# EAGLE design Grove - I2C High Accuracy Temp&Humi Sensor (SHT35) (EAGLE 6.4)
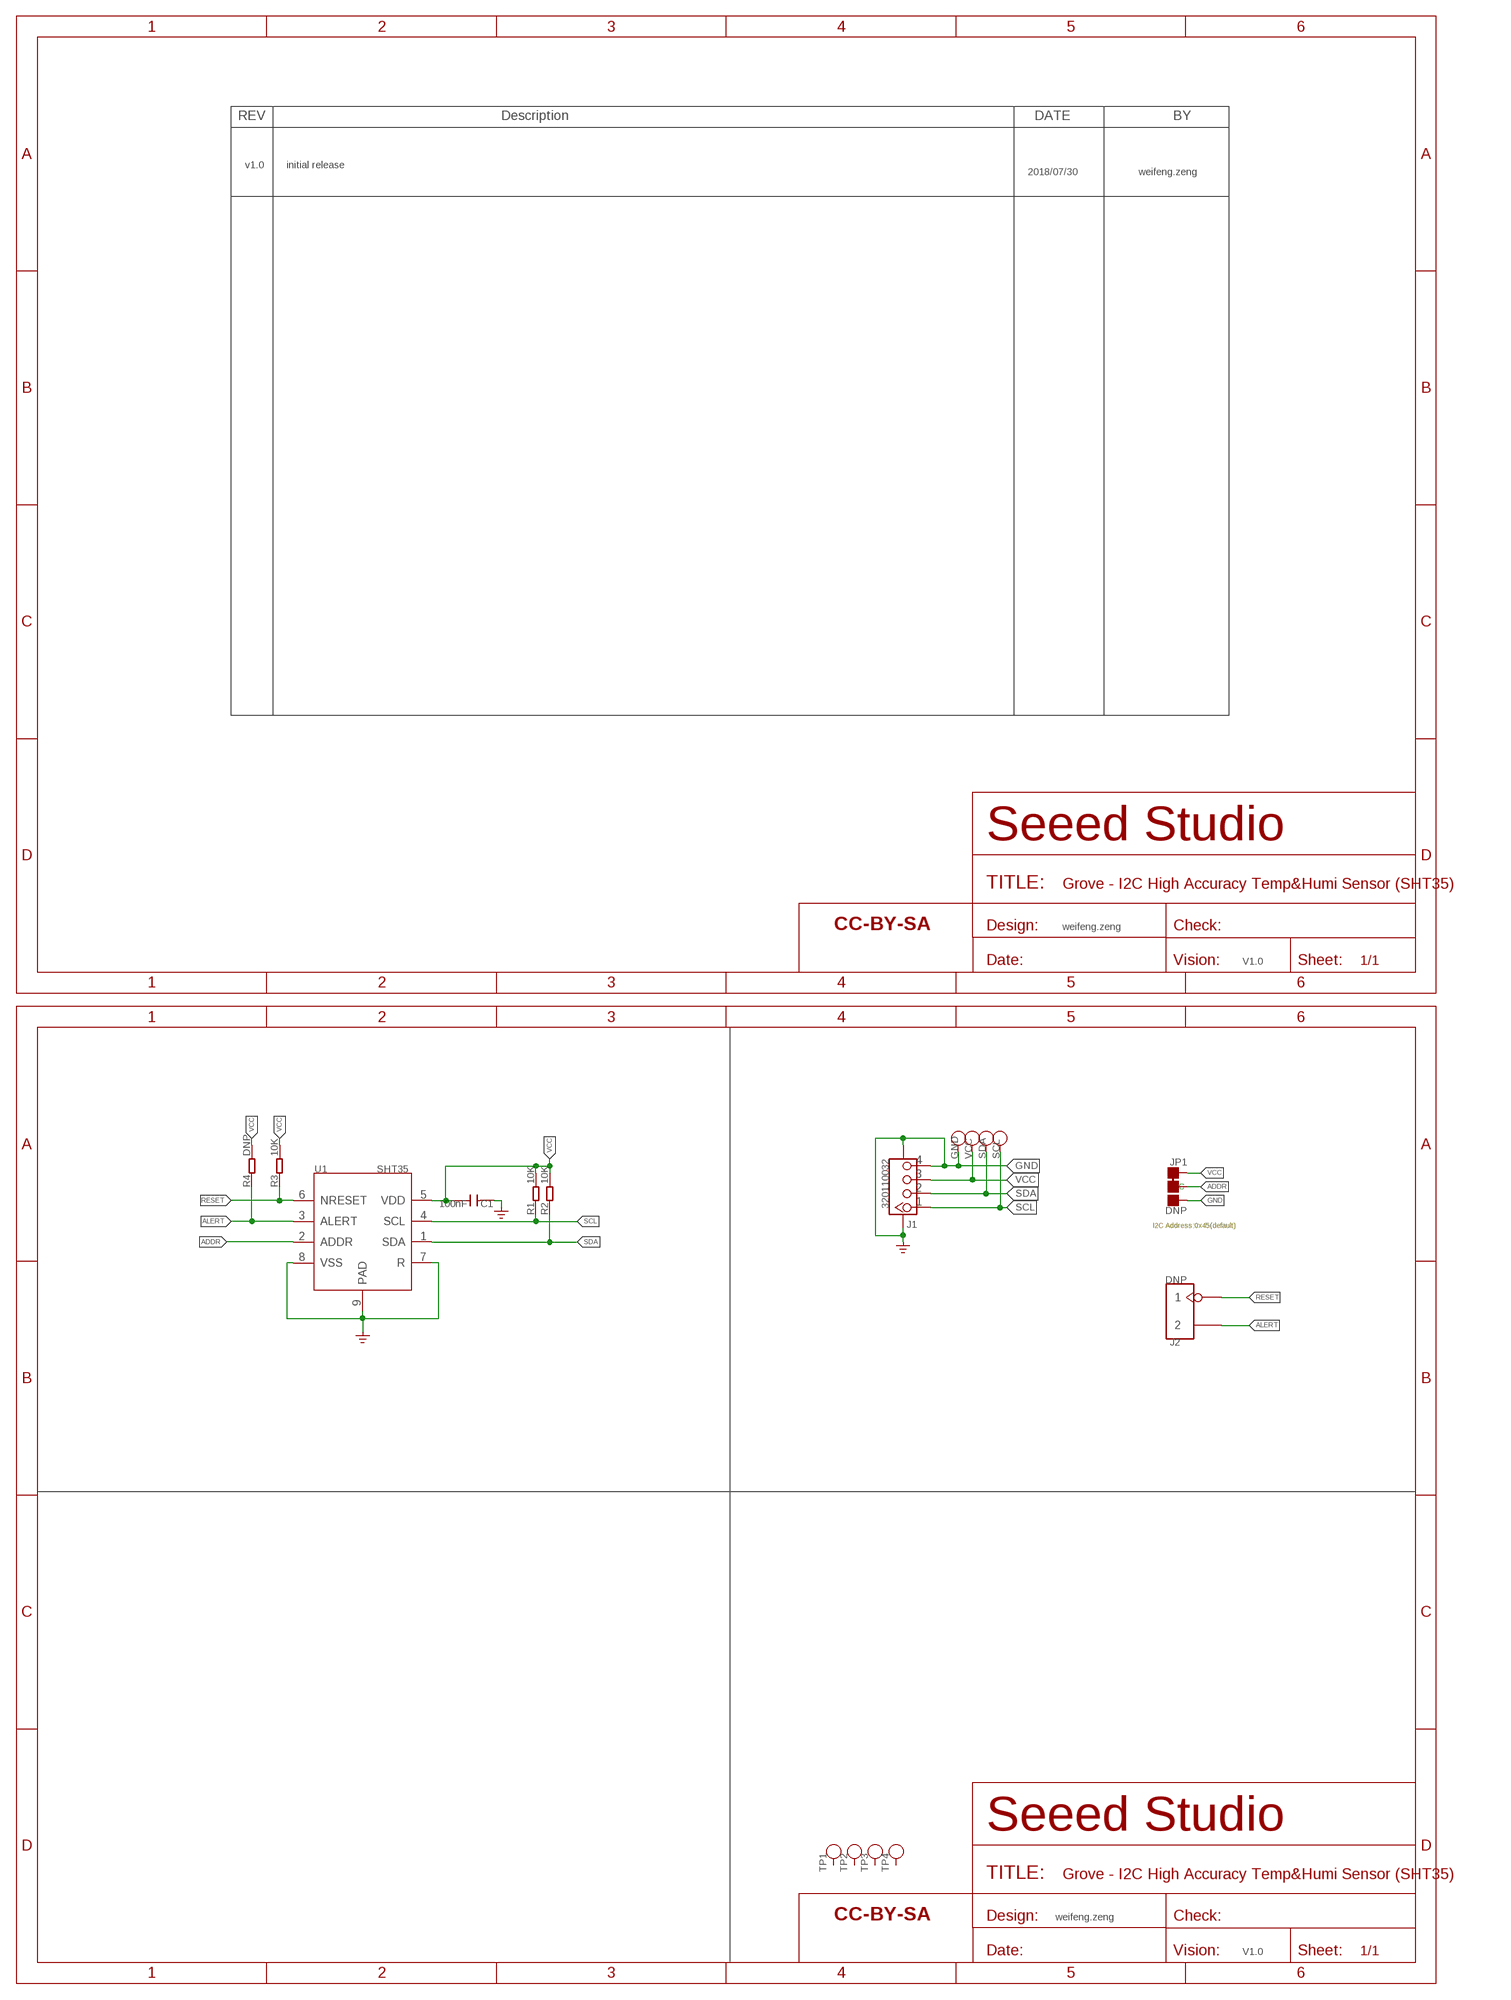
[diagram p0: schematic, sheet 1]

## Parts
C1  100nF  CAP-0603  [C0603]
FR1  SEEEDSTUDIO-OPEN-SCH-FRAME  [SEEEDSTUDIO-PCB-FRAME]
FR2  SEEEDSTUDIO-OPEN-SCH-FRAME  [SEEEDSTUDIO-PCB-FRAME]
GND  TEST-POINT'4545'  [TP-D45MIL]
J1  320110032  GROVE-CONNECTOR-SMD'90D'  [HW4-SMD-2.0-90D]
J2  DNP  HEADER-2P-65/35MIL  [H2-2.54]
JP1  DNP  JP-3P-SHORT  [3P-SMD-SHORT]
R1  10K  RES-0603  [R0603]
R2  10K  RES-0603  [R0603]
R3  10K  RES-0603  [R0603]
R4  DNP  RES-0603  [R0603]
SCL  TEST-POINT'4545'  [TP-D45MIL]
SDA  TEST-POINT'4545'  [TP-D45MIL]
TP1  TEST-POINT'4545'  [TP-D45MIL]
TP2  TEST-POINT'4545'  [TP-D45MIL]
TP3  TEST-POINT'4545'  [TP-D45MIL]
TP4  TEST-POINT'4545'  [TP-D45MIL]
U1  SHT35  SENSOR-SHT3X-DIS  [DFN8-0.5-2.5X2.5MM]
VCC  TEST-POINT'4545'  [TP-D45MIL]

## Nets
ADDR: JP1.MM(C) U1.2(ADDR)
ALERT: J2.2 R4.1 U1.3(ALERT)
GND: C1.2 GND.T J1.4 J1.SS1 J1.SS2 JP1.00(R) U1.7(R) U1.8(VSS) U1.9(PAD) ; supply symbol labelled GND_POWER
RESET: J2.1 R3.1 U1.6(NRESET)
SCL: J1.1 R1.1 SCL.T U1.4(SCL)
SDA: J1.2 R2.1 SDA.T U1.1(SDA)
VCC: C1.1 J1.3 JP1.11(L) R1.2 R2.2 R3.2 R4.2 U1.5(VDD) VCC.T
Unconnected: TP1.T TP2.T TP3.T TP4.T

## Notes on the sheet
- v1.0 | initial release
- 2018/07/30 | weifeng.zeng
- weifeng.zeng
- V1.0
- I2C Address:0x45(default)
- weifeng.zeng
- V1.0

## Library data of the parts
C1 = Discrete-new:CAP: Ceramic Capacitors
FR1 FR2 = moudle-new:SEEEDSTUDIO-OPEN-SCH-FRAME
GND SCL SDA TP1-TP4 VCC = Discrete-new:TEST-POINT; PARTNO: DNP
J1 = Connector-new:GROVE-CONNECTOR-SMD: 4P-SMD-2.0:320110030;4P-SMD-2.0-90D:320110032
J2 = Connector-new:HEADER-2P
JP1 = Discrete-new:JP-3P-SHORT
R1-R4 = Discrete-new:RES
U1 = Discrete-new:SENSOR-SHT3X-DIS

## Board
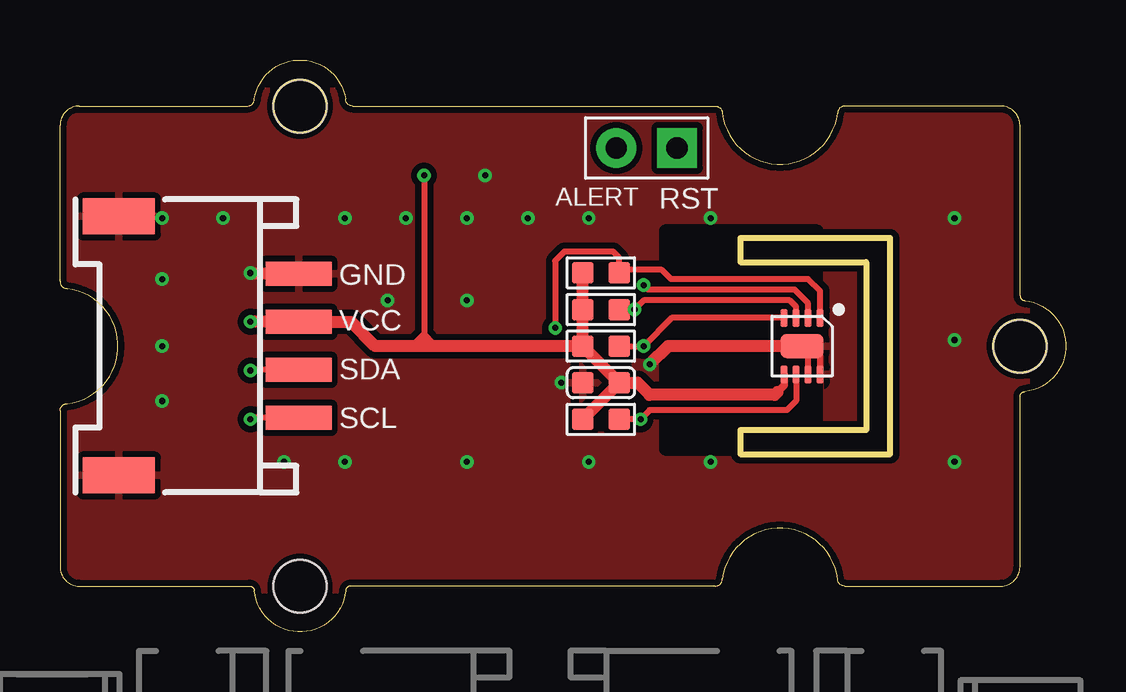
[diagram p1: board, top side]
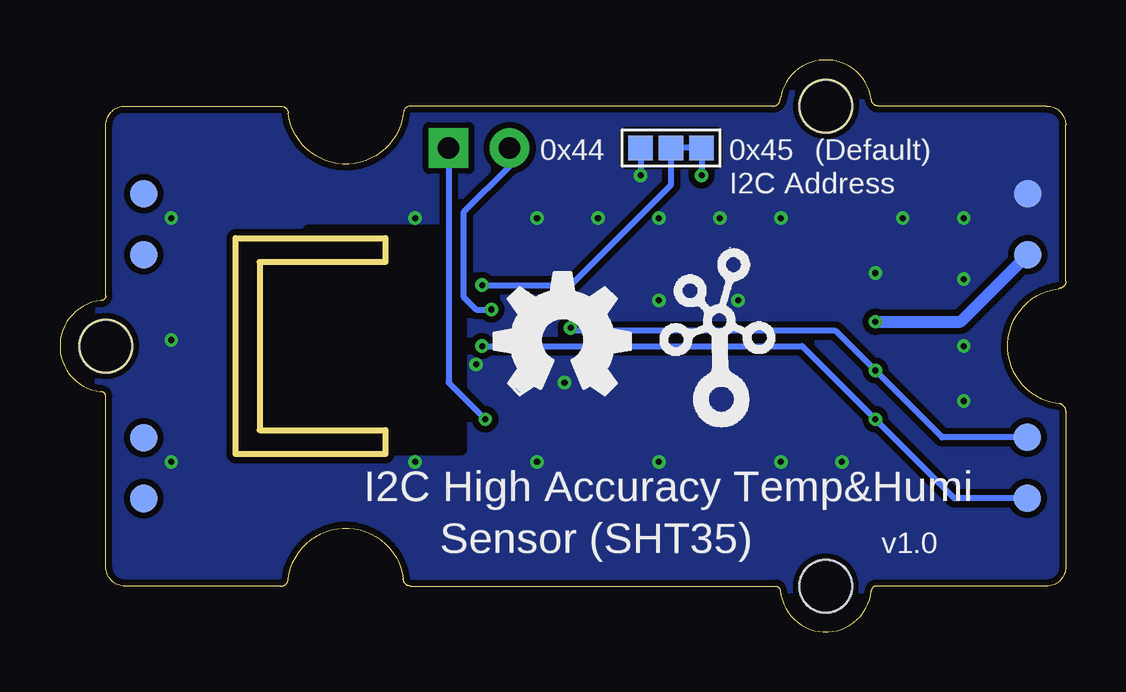
[diagram p2: board, bottom side, seen from below]

Size 41.91 x 23.83 mm. Coordinates in mm from the lower left corner, seen from the top.
Outline: 28.35,15.41 33.59,15.41 33.59,8.41 28.35,8.41 28.35,7.41 34.59,7.41 34.59,16.41 28.35,16.41 28.35,15.41
Copper layers (1*16): Top 0.035mm / dielectric 1.5mm / Bottom 0.035mm
Design rules "SeeedStudio_2layer_DRU_no_angle_20140221 *": minimum track width 6mil, minimum drill 10mil, track to track 6mil, track to pad 6mil, pad to pad 6mil, via to via 6mil, smd to smd 0mil, copper to edge 10mil, drill to drill 10mil, minimum pad ring 10mil, minimum via ring 6mil, stop-mask expansion 2mil, vias tented up to drill 25mil, thermal gap 10mil
tRestrict: area 25.2,7.6 to 31.6,16.7
bRestrict: area 25.2,7.6 to 31.6,16.7

### Footprints (pad centres in the part's own frame; a part is rotated, then mirrored left to right if it is on the bottom)
C0603 = smd 0.889 x 0.889: 1 0,0.762; 2 0,-0.762
TP-D45MIL = smd 1.143 x 1.143: T 0,0
HW4-SMD-2.0-90D = smd 1.01 x 2.74: 1 -3,-0.1; 2 -1,-0.1; 3 1,-0.1; 4 3,-0.1 | smd 1.5 x 3: SS1 -5.4,7.4; SS2 5.4,7.4
H2-2.54 = drill 0.889 pad 1.651 square: 1 0,1.27 | drill 0.889 pad 1.651: 2 0,-1.27
3P-SMD-SHORT = smd 1.016 x 1.016: 00 -1.27,0; 11 1.27,0; MM 0,0
R0603 = smd 0.889 x 0.889: 1 0,0.762; 2 0,-0.762
DFN8-0.5-2.5X2.5MM = smd 0.75 x 0.3: 1 -1.175,0.75; 2 -1.175,0.25; 3 -1.175,-0.25; 4 -1.175,-0.75; 5 1.175,-0.75; 6 1.175,-0.25; 7 1.175,0.25; 8 1.175,0.75 | smd 1 x 1.8: 9 0,0
GROVE-TEST-PLATFORM = hole 2.2: -10,-10; -10,10; 20,0

### Placement (x,y rotation side)
C1  22.54,10.38 270 top
FR1  -4.38,-9.05 0 top  (outside the outline)
FR2  -5.15,-19.46 0 top  (outside the outline)
GND  1.59,18.26 90 bottom
J1  9.85,11.92 90 top
J2  24.45,20.16 270 top
JP1  16.44,20.16 0 bottom
R1  22.54,11.91 270 top
R2  22.54,14.96 270 top
R3  22.54,8.86 270 top
R4  22.54,13.43 270 top
SCL  1.6,5.56 90 bottom
SDA  1.6,8.11 90 bottom
TP1  38.41,18.26 0 bottom
TP2  38.41,15.72 0 bottom
TP3  38.41,8.1 0 bottom
TP4  38.41,5.56 0 bottom
U1  30.92,11.91 270 top
U10  [GROVE-TEST-PLATFORM]  20,11.91 0 top
U$3  [OSHW_FILLX200_NOTEXT]  23.81,9.88 0 bottom
U$4  [TWIGLOGO]  14.41,9.5 0 bottom
VCC  1.59,15.72 90 bottom

### Tracks (layer width: path | path; a pad name or v marks a point on that pad's centre or on a via)
ADDR  (via drill 0.25 pad 0.51)
  Top 0.254: U1.2 31.17,13.69 30.6,14.26 24.51,14.26 v24.32,14.45
  Bottom 0.254: v24.32,14.45 20.64,14.45 16.44,18.64 JP1.MM
ALERT  (via drill 0.25 pad 0.51)
  Top 0.254: U1.3 30.67,13.56 30.41,13.81 24.32,13.81 v23.94,13.43 R4.1
  Bottom 0.254: v23.94,13.43 24.57,13.43 25.08,13.94 25.08,17.5 23.18,19.4 J2.2
GND  (via drill 0.25 pad 0.51)
  Top 0.254: U1.7 31.17,11.66 U1.9 31.3,11.91 31.67,11.54 U1.8
  Top 0.508: J1.4 7.97,14.92 v7.94,14.96 | U1.9 25.33,11.91 v24.57,11.15
  Bottom 0.254: JP1.00 v17.71,19.02
  other vias: 4.25,17.24 20.89,10.38 11.87,17.24 14.41,17.24 6.79,17.24 16.95,17.24 19.49,17.24 22.03,17.24 27.11,17.24 37.27,17.24 37.27,12.16 37.27,7.08 27.11,7.08 22.03,7.08 16.95,7.08 11.87,7.08 9.33,7.08 4.25,9.62 4.25,14.7 16.95,13.81 13.65,13.81 4.25,11.91
  pour Top (isolate 0.254, rank 6): -0.32,22.7 40.32,22.7 40.32,1.75 -0.32,1.75
  pour Bottom (isolate 0.254, rank 6): -0.32,22.7 40.32,22.7 40.32,1.75 -0.32,1.75
RESET  (via drill 0.25 pad 0.51)
  Top 0.254: R3.1 v24.19,8.86 24.57,9.24 30.29,9.24 30.67,9.63 U1.6
  Bottom 0.254: J2.1 25.71,10.38 v24.19,8.86
SCL  (via drill 0.25 pad 0.51)
  Top 0.254: U1.4 25.49,13.08 v24.32,11.91 R1.1 | J1.1 7.99,8.92 v7.94,8.86
  Bottom 0.254: v24.32,11.91 10.98,11.91 v7.94,8.86 4.64,5.56 SCL.T
SDA  (via drill 0.25 pad 0.51)
  Top 0.254: U1.1 31.67,14.21 31.18,14.7 25.46,14.7 25.08,15.08 23.43,15.08 R2.1 23.3,15.59 23.05,15.85 21.02,15.85 20.64,15.46 v20.64,12.67 | J1.2 7.96,10.92 v7.94,10.89
  Bottom 0.254: SDA.T 5.15,8.11 v7.94,10.89 9.59,12.54 20.51,12.54 v20.64,12.67
VCC  (via drill 0.25 pad 0.51)
  Top 0.254: v15.17,19.02 15.17,12.42 | 15.17,12.42 15.17,11.91 | 15.17,12.42 14.67,11.91 | 15.17,12.42 15.55,12.04
  Top 0.305: U1.5 30.17,10.27 29.91,10
  Top 0.508: 29.91,10 29.78,9.88 24.57,9.88 24.06,10.38 C1.1 | R3.2 C1.1 | C1.1 R1.2 | R1.2 R4.2 R2.2 | R1.2 15.17,11.91 14.67,11.91 13.14,11.91 12.13,12.92 J1.3 v7.94,12.92
  Bottom 0.254: JP1.11 v15.17,19.02
  Bottom 0.508: v7.94,12.92 4.38,12.92 VCC.T

### Text on the board
tPlace: ALERT | RST | GND | VCC | SDA | SCL
bPlace: (Default) | 0x45 | 0x44 | I2C Address | I2C High Accuracy Temp&Humi | v1.0 | Sensor (SHT35)